# Altium schematic sheet External_Memory_Power_Switch.SchDoc: External Memory Power Switch
size A; Revision: 1
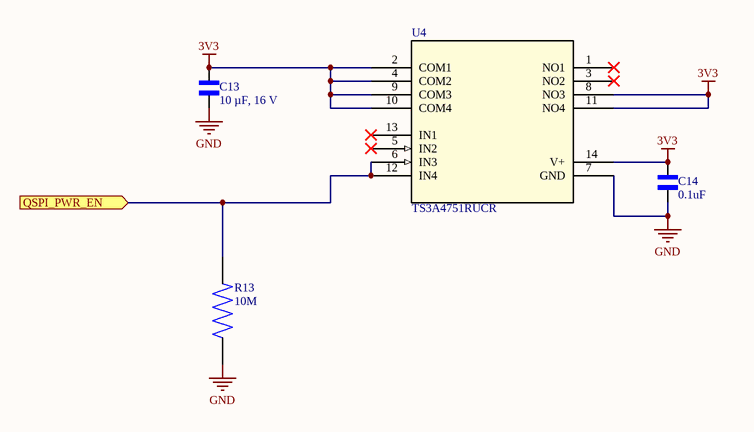
[diagram p0: External_Memory_Power_Switch.SchDoc]

## Parts
C13  10 µF, 16 V  [C0805]
C14  0.1uF  [C0402]
R13  10M  [R0402 Vishay]
U4  TS3A4751RUCR  [TS3A4751RUCR]

## Ports
QSPI_PWR_EN (in)

## Nets
3V3: C13.2 C14.2 U4.2(COM1) U4.4(COM2) U4.8(NO3) U4.9(COM3) U4.10(COM4) U4.11(NO4) U4.14(V+)
GND: C13.1 C14.1 R13.1 U4.7(GND)
QSPI_PWR_EN: R13.2 U4.6(IN3) U4.12(IN4) ; port QSPI_PWR_EN

Not connected (* = marked no-connect by the designer): U4 1(NO1)* 3(NO2)* 5(IN2)* 13(IN1)*

## Library data of the parts
C13 = C2012X5R1C106K085AC: TDK - C2012X5R1C106K085AC - SMD Multilayer Ceramic Capacitor, 10 µF, 16 V, 0805 [2012 Metric], ± 10%, X5R, C Series TDK; Capacitance: 10uF; Voltage Rating: 16V; Supplier 1: Digi-Key; Manufacturer: TDK; Manufacturer Part Number: C2012X5R1C106K085AC; RoHS: Yes; Category: Ceramic Capacitors; Stock 1: 1442350; Pricing 1: 1=0.25000, 10=0.17500, 100=0.09890, 500=0.06982, 1000=0.06110 (USD); Mount: Surface Mount; Case/Package: 0805; Number of Pins: 2; Weight: 0.000194oz; Case Code (Metric): 2012; Case Code (Imperial): 0805; Dielectric Material: Ceramic; Min Operating Temperature: -55°C; Max Operating Temperature: 85°C; Tolerance: 10%; Packaging: Tape and Reel; Voltage Rating (DC): 16V; Termination: SMD/SMT; Dielectric: X5R; Package Quantity: 1; Composition: Ceramic; Length: 2mm; Height: 0.85mm; Depth: 1.25mm; Width: 0.049inch; Thickness: 0.037inch; Lead Free: Lead Free; REACH SVHC: No SVHC; ComponentLink1URL: https://datasheet.ciiva.com/24218/c2012x5r1c106k085ac-264980-24218056.pdf?src-supplier=Mouser; ComponentLink1Description: https://datasheet.ciiva.com/24218/c2012x5r1c106k085ac-264980-24218056.pdf?src-supplier=Mouser; ComponentLink2URL: https://datasheet.ciiva.com/28451/1796654-28451610.pdf?src-supplier=Element14; ComponentLink2Description: https://datasheet.ciiva.com/28451/1796654-28451610.pdf?src-supplier=Element14; ComponentLink3URL: https://datasheet.ciiva.com/28602/1744655-28602170.pdf?src-supplier=Element14; ComponentLink3Description: https://datasheet.ciiva.com/28602/1744655-28602170.pdf?src-supplier=Element14; ComponentLink4URL: https://datasheet.ciiva.com/6259/tdkmlcccaprange-6259116.pdf?src-supplier=Digi-Key; ComponentLink4Description: https://datasheet.ciiva.com/6259/tdkmlcccaprange-6259116.pdf?src-supplier=Digi-Key; ComponentLink5URL: https://datasheet.ciiva.com/23803/1796654-23803020.pdf?src-supplier=Newark; ComponentLink5Description: https://datasheet.ciiva.com/23803/1796654-23803020.pdf?src-supplier=Newark; ComponentLink6URL: https://datasheet.ciiva.com/22719/1796654-22719549.pdf?src-supplier=Element14; ComponentLink6Description: https://datasheet.ciiva.com/22719/1796654-22719549.pdf?src-supplier=Element14; ComponentLink7URL: https://datasheet.ciiva.com/6259/tdkmlcccaprange-6259119.pdf?src-supplier=Digi-Key; ComponentLink7Description: https://datasheet.ciiva.com/6259/tdkmlcccaprange-6259119.pdf?src-supplier=Digi-Key; ComponentLink8URL: https://datasheet.ciiva.com/28673/mlcc-commercial-general-en-28673535.pdf?src-supplier=Element14; ComponentLink8Description: https://datasheet.ciiva.com/28673/mlcc-commercial-general-en-28673535.pdf?src-supplier=Element14; Supplier Part Number 1: 445-7644-1-ND
C14 = GRM022R60J104KE15L: CAP CER 0.1UF 6.3V X5R 01005; Manufacturer: Murata; Capacitance: 100nF; Tolerance: 10%; Supplier 1: Digi-Key; Manufacturer Part Number: GRM022R60J104KE15L; RoHS: No; Category: Ceramic Capacitors; Stock 1: 633064; Pricing 1: 1=0.13000, 10=0.09000, 50=0.05080, 100=0.04210, 500=0.02952, 1000=0.02444, 2500=0.02275, 5000=0.02081 (USD); Mount: Surface Mount; Case Code (Imperial): 1005; Case Code (Metric): 0402; Min Operating Temperature: -55°C; Max Operating Temperature: 85°C; Packaging: Cut Tape; Voltage Rating: 6.3V; ComponentLink1URL: http://search.murata.co.jp/Ceramy/image/img/A01X/G101/ENG/GRM022R60J104KE15-01.pdf?src-supplier=Digi-Key; ComponentLink1Description: http://search.murata.co.jp/Ceramy/image/img/A01X/G101/ENG/GRM022R60J104KE15-01.pdf?src-supplier=Digi-Key; Supplier Part Number 1: 490-16598-1-ND
R13 = CRCW040210M0FKED: RESISTOR, 0402, 10M, 1%, FULL REEL; Product Range:VISHAY - AEC-Q200 CRCW Series; Resistance:10Mohm; Power Rating:63mW; Resistance Tolerance:± 1%; Resistor Case Style:0402 [1005 Metric]; Resistor Element Material:Thick Film; ;RoHS Compliant: Yes; Manufacturer: Vishay; Resistance: 10MR; Temperature Coefficient: 100ppm/°C; Max Power Dissipation: 63mW; Voltage Rating: 50V; Supplier 1: Digi-Key; Manufacturer Part Number: CRCW040210M0FKED; RoHS: Yes; Category: Chip SMD Resistors; Stock 1: 167645; Pricing 1: 1=0.10000, 10=0.03300, 100=0.01330, 1000=0.00596, 2500=0.00518, 5000=0.00428 (USD); Mount: Surface Mount; Case/Package: 0402; Case Code (Metric): 1005; Case Code (Imperial): 0402; Weight: 2.3E-05oz; Contact Plating: Tin; Min Operating Temperature: -55°C; Max Operating Temperature: 155°C; Resistor Type: Thick Film; Tolerance: 1%; Packaging: Tape and Reel; Number of Terminations: 2; Power Rating: 63mW; Package Quantity: 10; Termination: SMD/SMT; Voltage Rating (DC): 50V; Features: Automotive AEC-Q200; Length: 1mm; Width: 0.02inch; Height: 0.35mm; Depth: 0.5mm; Radiation Hardening: No; REACH SVHC: Unknown; Military Standard: Not; Lead Free: Lead Free; ComponentLink1URL: https://datasheet.ciiva.com/11811/0900766b80d98824-11811586.pdf?src-supplier=RSComponents; ComponentLink1Description: https://datasheet.ciiva.com/11811/0900766b80d98824-11811586.pdf?src-supplier=RSComponents; ComponentLink2URL: https://datasheet.ciiva.com/2463/dcrcwe3-2463089.pdf?src-supplier=Digi-Key; ComponentLink2Description: https://datasheet.ciiva.com/2463/dcrcwe3-2463089.pdf?src-supplier=Digi-Key; ComponentLink3URL: https://datasheet.ciiva.com/2463/dcrcwe3-2463088.pdf?src-supplier=Digi-Key; ComponentLink3Description: https://datasheet.ciiva.com/2463/dcrcwe3-2463088.pdf?src-supplier=Digi-Key; ComponentLink4URL: https://datasheet.ciiva.com/2463/dcrcwe3-2463090.pdf?src-supplier=Digi-Key; ComponentLink4Description: https://datasheet.ciiva.com/2463/dcrcwe3-2463090.pdf?src-supplier=Digi-Key; ComponentLink5URL: https://datasheet.ciiva.com/5552/dcrcwe3-109170-5552597.pdf?src-supplier=Mouser; ComponentLink5Description: https://datasheet.ciiva.com/5552/dcrcwe3-109170-5552597.pdf?src-supplier=Mouser; ComponentLink6URL: https://datasheet.ciiva.com/16881/dcrcwe3-16881451.pdf?src-supplier=Avnet+Europe; ComponentLink6Description: https://datasheet.ciiva.com/16881/dcrcwe3-16881451.pdf?src-supplier=Avnet+Europe; ComponentLink7URL: https://datasheet.ciiva.com/26316/fld-crcw-e3-data-en-26316614.pdf?src-supplier=Distrelec; ComponentLink7Description: https://datasheet.ciiva.com/26316/fld-crcw-e3-data-en-26316614.pdf?src-supplier=Distrelec; ComponentLink8URL: https://datasheet.ciiva.com/16773/70201119-16773258.pdf?src-supplier=Allied+Electronics; ComponentLink8Description: https://datasheet.ciiva.com/16773/70201119-16773258.pdf?src-supplier=Allied+Electronics; Supplier Part Number 1: 541-10.0MLCT-ND
U4 = TS3A4751RUCR: https://www.ti.com/product/TS3A4751?HQS=TI-null-null-octopart-df-pf-null-wwe; Vendor: Texas Instruments; PACKAGE_DESIGNATOR: RUC; PIN_COUNT: 14; FAMILY_NAME: ANALOG SWITCH OR MULTIPLEXER (less than or equal to 5V); INDUSTRY_STD_PKG_TYPE: QFN; Manufacturer_Part_Number: TS3A4751RUCR; GENERIC_PART_NUMBER: TS3A4751; Datasheet_URL: http://www.ti.com/lit/gpn/TS3A4751; Manufacturer: Texas Instruments; Copyright: Copyright (C) 2018 Accelerated Designs. All rights reserved; RefDes: RefDes; Type: DEV